# Altium schematic sheet connector.SchDoc
size A4
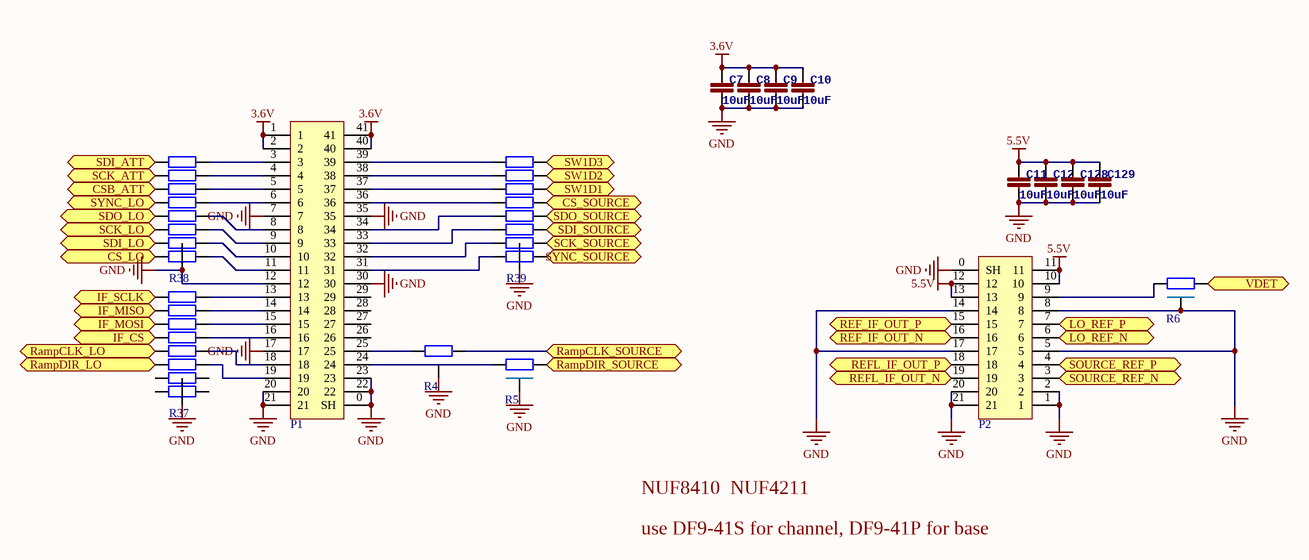
[diagram p0: connector.SchDoc]

## Parts
C7  10uF  [0603L]
C8  10uF  [0603L]
C9  10uF  [0603L]
C10  10uF  [0603L]
C11  10uF  [0603L]
C12  10uF  [0603L]
C128  10uF  [0603L]
C129  10uF  [0603L]
P1  DF9-41S  [DF9-41S]  (value not drawn)
P2  DF9-21  [DF9-21S]  (value not drawn)
R4  PiFilter  [PiFIiter]  (value not drawn)
R5  PiFilter  [PiFIiter]  (value not drawn)
R6  PiFilter  [PiFIiter]  (value not drawn)
R37  NUF8xxx  [NUF8xxx]  (value not drawn)
R38  NUF8xxx  [NUF8xxx]  (value not drawn)
R39  NUF8xxx  [NUF8xxx]  (value not drawn)

## Ports
CS_LO, CS_SOURCE, CSB_ATT, IF_CS, IF_MISO, IF_MOSI, IF_SCLK, LO_REF_N, LO_REF_P, RampCLK_LO, RampCLK_SOURCE, RampDIR_LO, RampDIR_SOURCE, REF_IF_OUT_N, REF_IF_OUT_P, REFL_IF_OUT_N, REFL_IF_OUT_P, SCK_ATT, SCK_LO, SCK_SOURCE, SDI_ATT, SDI_LO, SDI_SOURCE, SDO_LO, SDO_SOURCE, SOURCE_REF_N, SOURCE_REF_P, SW1D1, SW1D2, SW1D3, SYNC_LO, SYNC_SOURCE, VDET

## Nets
3.6V: C7.2 C8.2 C9.2 C10.2 P1.1 P1.2 P1.40 P1.41
5.5V: C11.2 C12.2 C128.2 C129.2 P2.10 P2.11 P2.12 P2.13
GND: C7.1 C8.1 C9.1 C10.1 C11.1 C12.1 C128.1 C129.1 P1.0(SH) P1.7 P1.12 P1.17 P1.20 P1.21 P1.22 P1.23 P1.30 P1.35 P2.0(SH) P2.1 P2.2 P2.5 P2.8 P2.14 P2.17 P2.20 P2.21 R4.3 R5.3 R6.3 R37.0 R38.0 R39.0
CS_LO: R38.8 ; port CS_LO
CS_SOURCE: R39.13 ; port CS_SOURCE
CSB_ATT: R38.3 ; port CSB_ATT
IF_CS: R37.4 ; port IF_CS
IF_MISO: R37.2 ; port IF_MISO
IF_MOSI: R37.3 ; port IF_MOSI
IF_SCLK: R37.1 ; port IF_SCLK
LO_REF_N: P2.6 ; port LO_REF_N
LO_REF_P: P2.7 ; port LO_REF_P
RampCLK_LO: R37.5 ; port RampCLK_LO
RampCLK_SOURCE: R4.1 ; port RampCLK_SOURCE
RampDIR_LO: R37.6 ; port RampDIR_LO
RampDIR_SOURCE: R5.2 ; port RampDIR_SOURCE
REF_IF_OUT_N: P2.16 ; port REF_IF_OUT_N
REF_IF_OUT_P: P2.15 ; port REF_IF_OUT_P
REFL_IF_OUT_N: P2.19 ; port REFL_IF_OUT_N
REFL_IF_OUT_P: P2.18 ; port REFL_IF_OUT_P
SCK_ATT: R38.2 ; port SCK_ATT
SCK_LO: R38.6 ; port SCK_LO
SCK_SOURCE: R39.10 ; port SCK_SOURCE
SDI_ATT: R38.1 ; port SDI_ATT
SDI_LO: R38.7 ; port SDI_LO
SDI_SOURCE: R39.11 ; port SDI_SOURCE
SDO_LO: R38.5 ; port SDO_LO
SDO_SOURCE: R39.12 ; port SDO_SOURCE
SOURCE_REF_N: P2.3 ; port SOURCE_REF_N
SOURCE_REF_P: P2.4 ; port SOURCE_REF_P
SW1D1: R39.14 ; port SW1D1
SW1D2: R39.15 ; port SW1D2
SW1D3: R39.16 ; port SW1D3
SYNC_LO: R38.4 ; port SYNC_LO
SYNC_SOURCE: R39.9 ; port SYNC_SOURCE
VDET: R6.1 ; port VDET
NetP1_3: P1.3 R38.16
NetP1_4: P1.4 R38.15
NetP1_5: P1.5 R38.14
NetP1_6: P1.6 R38.13
NetP1_8: P1.8 R38.12
NetP1_9: P1.9 R38.11
NetP1_10: P1.10 R38.10
NetP1_11: P1.11 R38.9
NetP1_13: P1.13 R37.16
NetP1_14: P1.14 R37.15
NetP1_15: P1.15 R37.14
NetP1_16: P1.16 R37.13
NetP1_18: P1.18 R37.12
NetP1_19: P1.19 R37.11
NetP1_24: P1.24 R5.1
NetP1_25: P1.25 R4.2
NetP1_31: P1.31 R39.8
NetP1_32: P1.32 R39.7
NetP1_33: P1.33 R39.6
NetP1_34: P1.34 R39.5
NetP1_36: P1.36 R39.4
NetP1_37: P1.37 R39.3
NetP1_38: P1.38 R39.2
NetP1_39: P1.39 R39.1
NetP2_9: P2.9 R6.2

Not connected (* = marked no-connect by the designer): P1 26 27 28 29; R37 7 8 9 10

## Notes on the sheet
- use DF9-41S for channel, DF9-41P for base
- NUF8410  NUF4211

## Library data of the parts
C7-C12 C128 C129 = CAP0402-CAP: <b>Capacitor</b> / Standard 0603 ceramic capacitor, and 0.1" leaded capacitor.; PARTNO: CC0402ZRY5V7BB104